# EAGLE design BumperDuino (EAGLE 6.4)
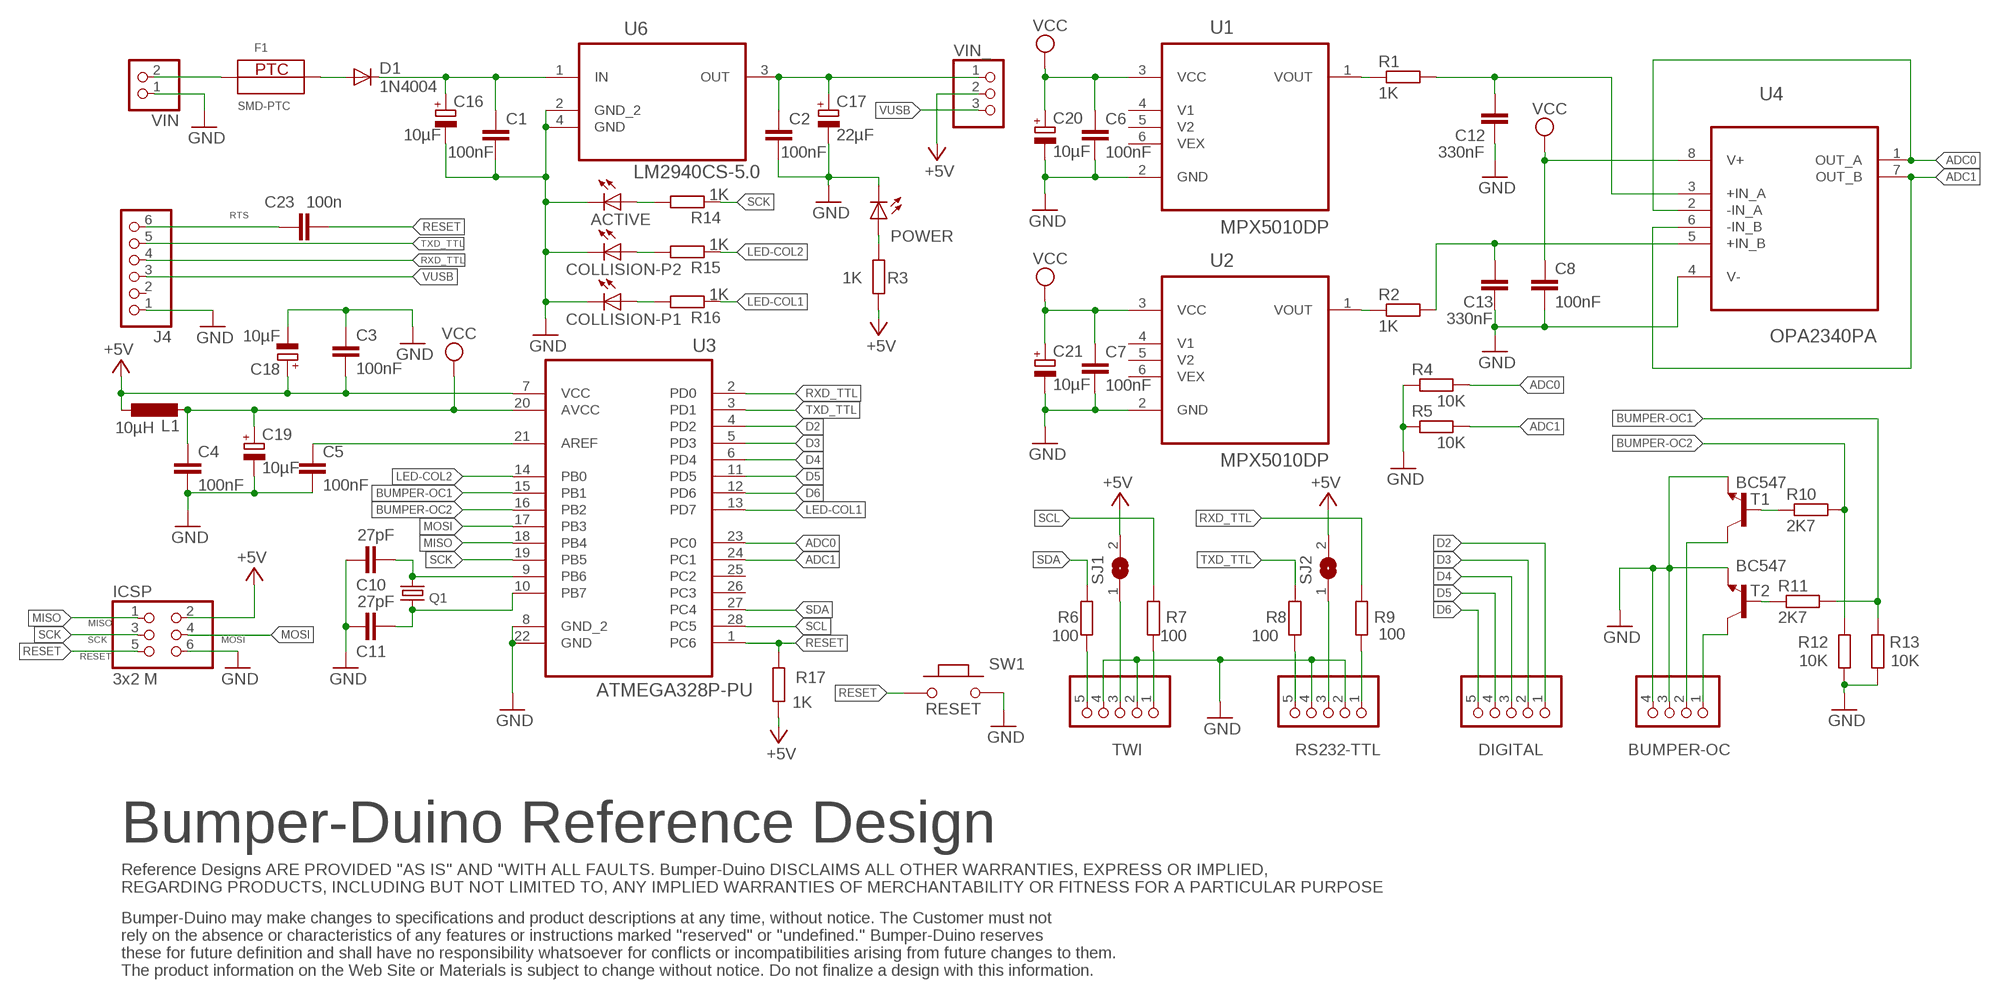
[diagram p0: schematic, sheet 1]

## Parts
ACTIVE  LED3MM  [LED3MM]
BUMPER-OC  PINHD-1X4  [1X04]
C1  100nF  C-EU025-025X050  [C025-025X050]
C2  100nF  C-EU025-025X050  [C025-025X050]
C3  100nF  C-EU025-025X050  [C025-025X050]
C4  100nF  C-EU025-025X050  [C025-025X050]
C5  100nF  C-EU025-025X050  [C025-025X050]
C6  100nF  C-EU025-025X050  [C025-025X050]
C7  100nF  C-EU025-025X050  [C025-025X050]
C8  100nF  C-EU025-025X050  [C025-025X050]
C10  27pF  C-EU025-025X050  [C025-025X050]
C11  27pF  C-EU025-025X050  [C025-025X050]
C12  330nF  C-EU025_050-035X075  [C025_050-035X075]
C13  330nF  C-EU025_050-035X075  [C025_050-035X075]
C16  10µF  CPOL-EUE2.5-5  [E2,5-5]
C17  22µF  CPOL-EUE2.5-5  [E2,5-5]
C18  10µF  CPOL-EUE2.5-5  [E2,5-5]
C19  10µF  CPOL-EUE2.5-5  [E2,5-5]
C20  10µF  CPOL-EUE2.5-5  [E2,5-5]
C21  10µF  CPOL-EUE2.5-5  [E2,5-5]
C23  100n  C-EU025-025X050  [C025-025X050]
COLLISION-P1  LED3MM  [LED3MM]
COLLISION-P2  LED3MM  [LED3MM]
D1  1N4004  [DO41-10]
DIGITAL  PINHD-1X5  [1X05]
F1  SMD-PTC  [SMD-PTC]
ICSP  3x2 M  PINHD-2X3  [2X03]
J4  6x1F Low profile (machined)  PINHD-1X6TH  [1X06-TH]
L1  10µH  L-EU0204/7  [0204/7]
POWER  LED3MM  [LED3MM]
Q1  HC49/S  [HC49/S]
R1  1K  R-EU_R1206  [R1206]
R2  1K  R-EU_R1206  [R1206]
R3  1K  R-EU_R1206  [R1206]
R4  10K  R-EU_R1206  [R1206]
R5  10K  R-EU_R1206  [R1206]
R6  100  R-EU_R1206  [R1206]
R7  100  R-EU_R1206  [R1206]
R8  100  R-EU_R1206  [R1206]
R9  100  R-EU_R1206  [R1206]
R10  2K7  R-EU_R1206  [R1206]
R11  2K7  R-EU_R1206  [R1206]
R12  10K  R-EU_R1206  [R1206]
R13  10K  R-EU_R1206  [R1206]
R14  1K  R-EU_R1206  [R1206]
R15  1K  R-EU_R1206  [R1206]
R16  1K  R-EU_R1206  [R1206]
R17  1K  R-EU_R1206  [R1206]
RS232-TTL  PINHD-1X5  [1X05]
SJ1  SJW  [SJW]
SJ2  SJW  [SJW]
SW1  RESET  PB157  [157SW]
T1  BC547  [TO92]
T2  BC547  [TO92]
TWI  PINHD-1X5  [1X05]
U1  MPX5010DP  [FREESCALE_CASE_867C-05]
U2  MPX5010DP  [FREESCALE_CASE_867C-05]
U3  ATMEGA328P-PU  [DIP254P762X457-28]
U4  OPA2340PA  [DIP254P762X508-8]
U6  LM2940CS-5.0  [TO254P1435X464-4N]
VIN  PINHD-1X2  [1X02]
VIN_  PINHD-1X3  [1X03]

## Nets
ADC0: R4.2 U3.23(PC0) U4.1(OUT_A) U4.2(-IN_A)
ADC1: R5.2 U3.24(PC1) U4.6(-IN_B) U4.7(OUT_B)
BUMPER-OC1: R11.2 R13.2 U3.15(PB1)
BUMPER-OC2: R10.2 R12.2 U3.16(PB2)
D2: DIGITAL.1 U3.4(PD2)
D3: DIGITAL.2 U3.5(PD3)
D4: DIGITAL.3 U3.6(PD4)
D5: DIGITAL.4 U3.11(PD5)
D6: DIGITAL.5 U3.12(PD6)
GND [usbvcc]: ACTIVE.K(C) BUMPER-OC.3 BUMPER-OC.4 C1.2 C2.2 C3.1 C4.2 C5.2 C6.2 C7.2 C8.2 C10.1 C11.1 C12.2 C13.2 C16.- C17.- C18.- C19.- C20.- C21.- COLLISION-P1.K(C) COLLISION-P2.K(C) ICSP.6 J4.1 POWER.K(C) R4.1 R5.1 R12.1 R13.1 RS232-TTL.2 RS232-TTL.4 SW1.2 T1.1(E) T2.1(E) TWI.2 TWI.4 U1.2(GND) U2.2(GND) U3.8(GND_2) U3.22(GND) U4.4(V-) U6.2(GND_2) U6.4(GND) VIN.1
LED-COL1: R16.1 U3.13(PD7)
LED-COL2: R15.1 U3.14(PB0)
MISO: ICSP.1 U3.18(PB4)
MOSI: ICSP.4 U3.17(PB3)
N$1: C10.2 Q1.2 U3.9(PB6)
N$2: C11.2 Q1.1 U3.10(PB7)
N$3: R1.1 U1.1(VOUT)
N$8: R2.1 U2.1(VOUT)
N$9 [usbvcc]: C1.1 C16.+ D1.C U6.1(IN)
N$10 [usbvcc]: C2.1 C17.+ U6.3(OUT) VIN_.1
N$13: C5.1 U3.21(AREF)
N$15: C12.1 R1.2 U4.3(+IN_A)
N$16: C13.1 R2.2 U4.5(+IN_B)
N$17: ACTIVE.A R14.2
N$18: COLLISION-P2.A R15.2
N$20 [usbvcc]: D1.A F1.2
N$21 [usbvcc]: F1.1 VIN.2
N$22: POWER.A R3.2
N$23: COLLISION-P1.A R16.2
N$24: R6.1 TWI.5
N$25: R7.1 TWI.1
N$26: R8.1 RS232-TTL.5
N$27: R9.1 RS232-TTL.1
N$28: BUMPER-OC.1 T2.3(C)
N$29: BUMPER-OC.2 T1.3(C)
N$31 [usbvcc]: SJ1.1 TWI.3
N$32: R11.1 T2.2(B)
N$33: R10.1 T1.2(B)
N$34 [usbvcc]: RS232-TTL.3 SJ2.1
RESET: C23.1 ICSP.5 R17.2 SW1.1 U3.1(PC6)
RTS: C23.2 J4.6
RXD_TTL: J4.4 R9.2 U3.2(PD0)
SCK: ICSP.3 R14.1 U3.19(PB5)
SCL: R7.2 U3.28(PC5)
SDA: R6.2 U3.27(PC4)
TXD_TTL: J4.5 R8.2 U3.3(PD1)
V5+ [usbvcc]: C3.2 C18.+ ICSP.2 L1.1 R3.1 R17.1 SJ1.2 SJ2.2 U3.7(VCC) VIN_.2 ; supply symbol labelled +5V
VCC: C4.1 C6.1 C7.1 C8.1 C19.+ C20.+ C21.+ L1.2 U1.3(VCC) U2.3(VCC) U3.20(AVCC) U4.8(V+)
VUSB [usbvcc]: J4.3 VIN_.3
Unconnected: J4.2 U1.4(V1) U1.5(V2) U1.6(VEX) U2.4(V1) U2.5(V2) U2.6(VEX) U3.25(PC2) U3.26(PC3)

## Notes on the sheet
- Bumper-Duino Reference Design
- Reference Designs ARE PROVIDED "AS IS" AND "WITH ALL FAULTS. Bumper-Duino DISCLAIMS ALL OTHER WARRANTIES, EXPRESS OR IMPLIED,
  REGARDING PRODUCTS, INCLUDING BUT NOT LIMITED TO, ANY IMPLIED WARRANTIES OF MERCHANTABILITY OR FITNESS FOR A PARTICULAR PURPOSE
- Bumper-Duino may make changes to specifications and product descriptions at any time, without notice. The Customer must not
  rely on the absence or characteristics of any features or instructions marked "reserved" or "undefined." Bumper-Duino reserves
  these for future definition and shall have no responsibility whatsoever for conflicts or incompatibilities arising from future changes to them.
  The product information on the Web Site or Materials is subject to change without notice. Do not finalize a design with this information.

## Library data of the parts
ACTIVE COLLISION-P1 COLLISION-P2 POWER = led:LED: LED OSRAM: - CHIPLED LG R971, LG N971, LY N971, LG Q971, LY Q971, LO R971, LY R971 LH N974, LH R974 LS Q976, LO Q976, LY Q976 LO Q996 - Hyper CHIPLED LW Q18S LB Q993, LB Q99A, LB R99A - SideLED LS A670, LO A670, LY A670, LG A670, LP A670 LB A673, LV A673, LT A673, LW A673 LH A674 LY A675 LS A676, LA A676, LO A676, LY A676, LW A676 LS A679, LY A679, LG A679 - Hyper Micro SIDELED® LS Y876, LA Y876, LO Y876, LY Y876 LT Y87S - SmartLED LW L88C, LW L88S LB L89C, LB L89S, LG L890 LS L89K, LO L89K, LY L89K LS L896, LA L896, LO L896, LY L896 - TOPLED LS T670, LO T670, LY T670, LG T670, LP T670 LSG T670, LSP T670, LSY T670, LOP T670, LYG T670 LG T671, LOG T671, LSG T671 LB T673, LV T673, LT T673, LW T673 LH T674 LS T676, LA T676, LO T676, LY T676, LB T676, LH T676, LSB T676, LW T676 LB T67C, LV T67C, LT T67C, LS T67K, LO T67K, LY T67K, LW E67C LS E67B, LA E67B, LO E67B, LY E67B, LB E67C, LV E67C, LT E67C LW T67C LS T679, LY T679, LG T679 LS T770, LO T770, LY T770, LG T770, LP T770 LB T773, LV T773, LT T773, LW T773 LH T774 LS E675, LA E675, LY E675, LS T675 LS T776, LA T776, LO T776, LY T776, LB T776 LHGB T686 LT T68C, LB T68C - Hyper Mini TOPLED® LB M676 - Mini TOPLED Santana® LG M470 LS M47K, LO M47K, LY M47K Source: http://www.osram.convergy.de LUXEON: - LUMILED® LXK2-PW12-R00, LXK2-PW12-S00, LXK2-PW14-U00, LXK2-PW14-V00 LXK2-PM12-R00, LXK2-PM12-S00, LXK2-PM14-U00 LXK2-PE12-Q00, LXK2-PE12-R00, LXK2-PE12-S00, LXK2-PE14-T00, LXK2-PE14-U00 LXK2-PB12-K00, LXK2-PB12-L00, LXK2-PB12-M00, LXK2-PB14-N00, LXK2-PB14-P00, LXK2-PB14-Q00 LXK2-PR12-L00, LXK2-PR12-M00, LXK2-PR14-Q00, LXK2-PR14-R00 LXK2-PD12-Q00, LXK2-PD12-R00, LXK2-PD12-S00 LXK2-PH12-R00, LXK2-PH12-S00 LXK2-PL12-P00, LXK2-PL12-Q00, LXK2-PL12-R00 Source: www.luxeon.com KINGBRIGHT: KA-3528ASYC Source: www.kingbright.com
BUMPER-OC = pinhead:PINHD-1X4: PIN HEADER
C1-C8 C10-C13 C23 = resistor:C-EU: CAPACITOR, European symbol
C16-C21 = resistor:CPOL-EU: POLARIZED CAPACITOR, European symbol
D1 = diode:1N4004: DIODE general purpose rectifier, 1 A
DIGITAL RS232-TTL TWI = pinhead:PINHD-1X5: PIN HEADER
F1 = Sicherungen Siba:SMD-PTC
ICSP = SmartPrj:PINHD-2X3: PIN HEADER
J4 = SmartPrj:PINHD-1X6: PIN HEADER
L1 = resistor:L-EU: INDUCTOR, European symbol
Q1 = quartz:HC49/S
R1-R17 = resistor:R-EU_: RESISTOR, European symbol
SJ1 SJ2 = jumper:SJ: SMD solder JUMPER
SW1 = MySMD:PB157
T1 T2 = transistor:BC547: NPN TRANSISTOR
U1 U2 = MXP5010DP:MPX5010DP: IC, IC, PRESSURE SENSOR,CASE 867C-05; MPN: MPX5010DP; OC_FARNELL: 1555605; OC_NEWARK: 07F9909; PACKAGE: CASE 867C-05; SUPPLIER: FREESCALE SEMICONDUCTOR
U3 = Atmel_By_element14_Batch_1-00:ATMEGA328P-PU: 8-bit Microcontroller with In-System Programmable Flash; MPN: ATMEGA328P-PU; OC_FARNELL: 1715487; OC_NEWARK: 15R0268; PACKAGE: PDIP-28; SUPPLIER: Atmel
U4 = OPA2340PA:OPA2340PA: OPERATIONAL AMPLIFIER; MPN: OPA2340PA; OC_FARNELL: 1129252; OC_NEWARK: 62K3460; PACKAGE: PDIP; SUPPLIER: Texas Instruments
U6 = LM2940CS-5.0:LM2940CS-5.0: Dropout Regulator; MPN: LM2940CS-5.0; OC_FARNELL: 9779850; OC_NEWARK: 07B6352; PACKAGE: TO-263-3; SUPPLIER: NationalSemiconductor
VIN = pinhead:PINHD-1X2: PIN HEADER
VIN_ = pinhead:PINHD-1X3: PIN HEADER

## Net classes
1 power: width 0.152 mm, drill 0.61 mm, clearance 0.152 mm
2 gnd: width 0.305 mm, drill 0.559 mm, clearance 0.254 mm
3 usbvcc: width 0.508 mm, drill 0.61 mm, clearance 0.254 mm

## Board
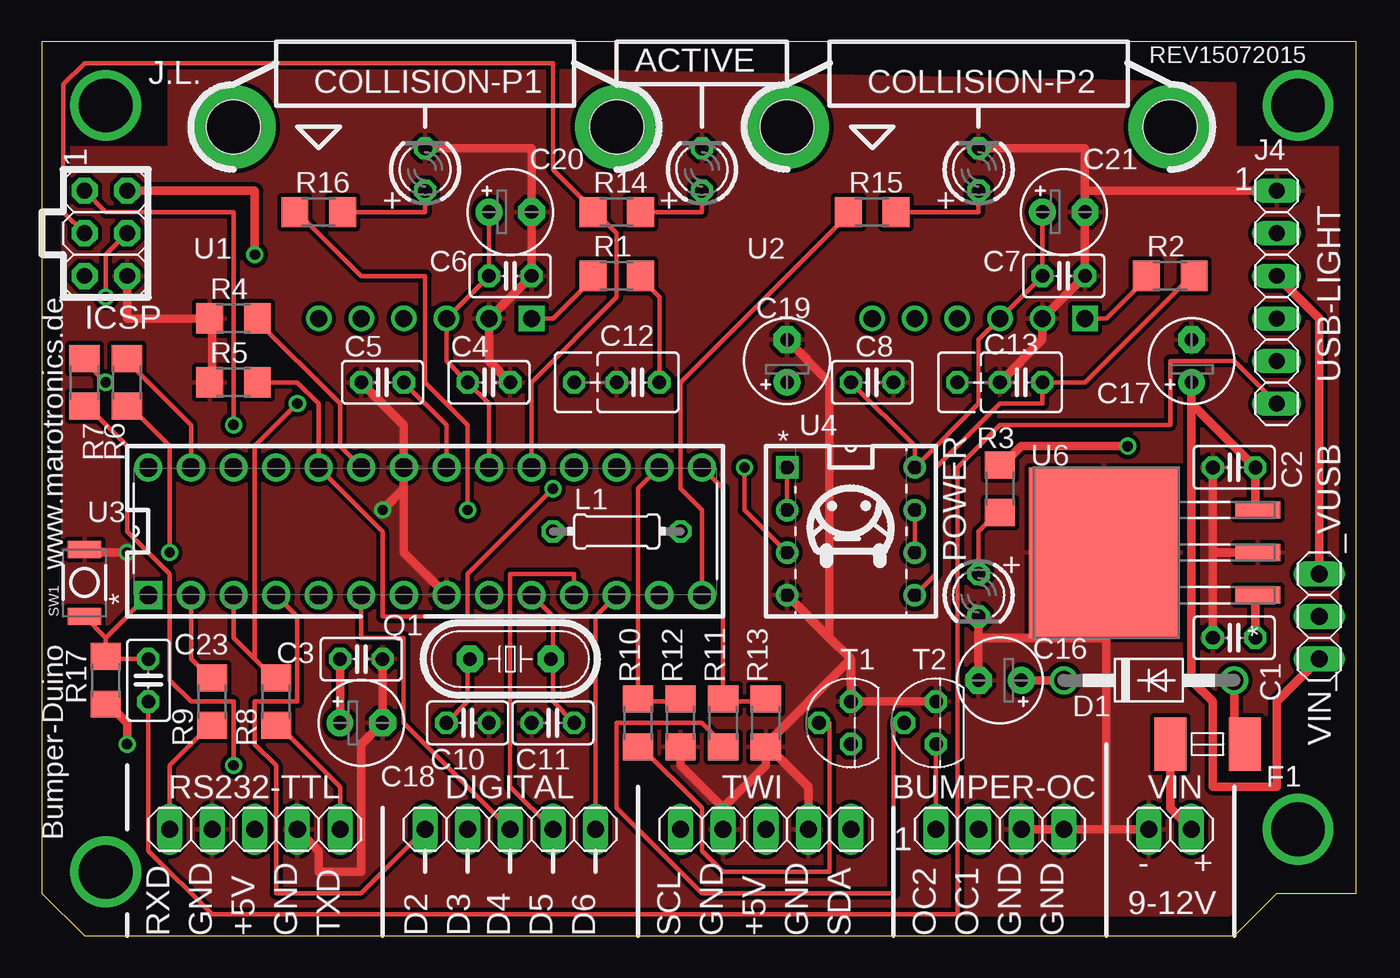
[diagram p1: board, top side]
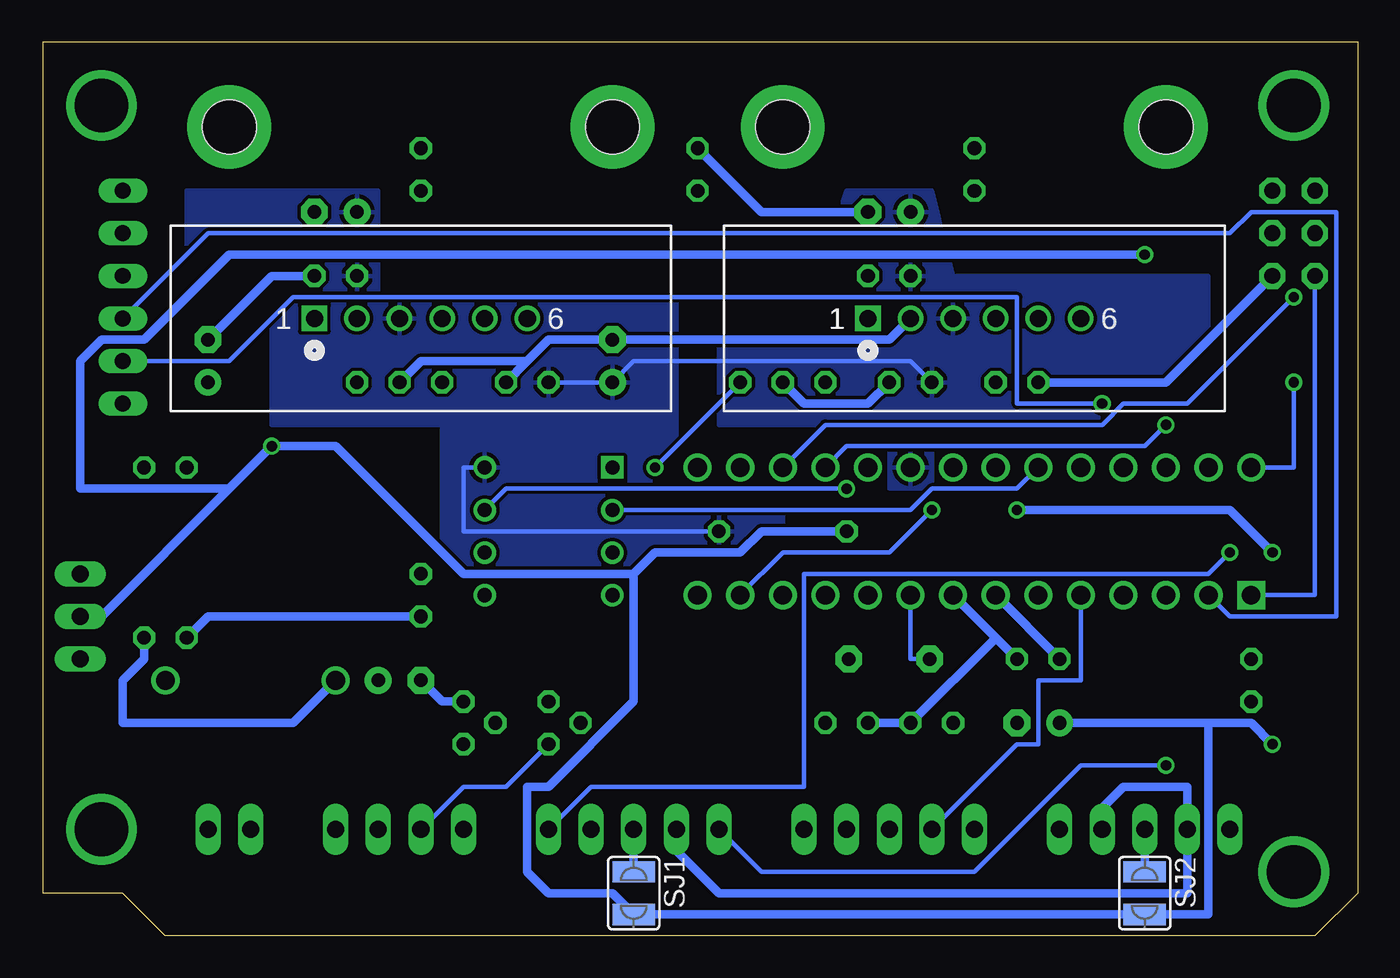
[diagram p2: board, bottom side, seen from below]

Size 78.41 x 53.33 mm. Coordinates in mm from the lower left corner, seen from the top.
Outline: 0,2.54 2.54,0 71.12,0 73.66,2.54 78.41,2.54 78.41,53.33 0,53.33 0,2.54
Copper layers (1*16): Top 0.035mm / dielectric 1.5mm / Bottom 0.035mm
Design rules "default": minimum track width 10mil, minimum drill 24mil, track to track 8mil, track to pad 8mil, pad to pad 8mil, via to via 8mil, smd to smd 8mil, copper to edge 40mil, drill to drill 8mil, minimum pad ring 10mil, minimum via ring 8mil, stop-mask expansion 4mil, vias tented up to drill 0mil, thermal gap 10mil
Holes 3.2 mm at 11.43,48.26 34.29,48.26 44.45,48.26 67.31,48.26

### Footprints (pad centres in the part's own frame; a part is rotated, then mirrored left to right if it is on the bottom)
LED3MM = drill 0.813 octagon: A -1.27,0; K 1.27,0
1X04 = drill 1.016 long: 1 -3.81,0; 2 -1.27,0; 3 1.27,0; 4 3.81,0
C025-025X050 = drill 0.813 octagon: 1 -1.27,0; 2 1.27,0
C025_050-035X075 = drill 0.813 octagon: 1 -1.27,0; 2 1.27,0; 3 3.81,0
E2,5-5 = drill 0.813 pad 1.6: + -1.27,0 | drill 0.813 pad 1.6 octagon: - 1.27,0
DO41-10 = drill 1.118: A 5.08,0; C -5.08,0
1X05 = drill 1.016 long: 1 -5.08,0; 2 -2.54,0; 3 0,0; 4 2.54,0; 5 5.08,0
SMD-PTC = smd 1.9 x 3.2: 1 0,0; 2 4.445,0
2X03 = drill 0.95 pad 1.55 octagon: 1 -2.54,-1.27; 2 -2.54,1.27; 3 0,-1.27; 4 0,1.27; 5 2.54,-1.27; 6 2.54,1.27
1X06-TH = drill 0.95 pad 1.422 long: 1 -6.35,0; 2 -3.81,0; 3 -1.27,0; 4 1.27,0; 5 3.81,0; 6 6.35,0
0204/7 = drill 0.813 octagon: 1 -3.81,0; 2 3.81,0
HC49/S = drill 0.813 pad 1.6 octagon: 1 -2.413,0; 2 2.413,0
R1206 = smd 1.6 x 1.803: 1 -1.422,0; 2 1.422,0
SJW = smd 1.27 x 2.54: 1 -1.27,0; 2 1.27,0
157SW = smd 1.016 x 1.981: 1 0,0; 2 4,0
TO92 = drill 0.813 octagon: 1 1.27,0; 2 0,1.905; 3 -1.27,0
FREESCALE_CASE_867C-05 = drill 1.016 square: 1 -12.7,0 | drill 1.016: 2 -10.16,0; 3 -7.62,0; 4 -5.08,0; 5 -2.54,0; 6 0,0
DIP254P762X457-28 = drill 1.118 square: 1 -7.62,33.02 | drill 1.118: 2 -7.62,30.48; 3 -7.62,27.94; 4 -7.62,25.4; 5 -7.62,22.86; 6 -7.62,20.32; 7 -7.62,17.78; 8 -7.62,15.24; 9 -7.62,12.7; 10 -7.62,10.16; 11 -7.62,7.62; 12 -7.62,5.08; 13 -7.62,2.54; 14 -7.62,0; 15 0,0; 16 0,2.54; 17 0,5.08; 18 0,7.62; 19 0,10.16; 20 0,12.7; 21 0,15.24; 22 0,17.78; 23 0,20.32; 24 0,22.86; 25 0,25.4; 26 0,27.94; 27 0,30.48; 28 0,33.02
DIP254P762X508-8 = drill 0.838 square: 1 -7.62,7.62 | drill 0.838: 2 -7.62,5.08; 3 -7.62,2.54; 4 -7.62,0; 5 0,0; 6 0,2.54; 7 0,5.08; 8 0,7.62
TO254P1435X464-4N = smd 1.016 x 2.692: 1 -2.54,-9.042; 2 0,-9.042; 3 2.54,-9.042 | smd 10.16 x 8.941: 4 0,0.152
1X02 = drill 1.016 long: 1 -1.27,0; 2 1.27,0
1X03 = drill 1.016 long: 1 -2.54,0; 2 0,0; 3 2.54,0

### Placement (x,y rotation side)
ACTIVE  39.37,45.72 90 top
BUMPER-OC  57.15,6.35 0 top
C1  71.12,17.78 180 top
C2  71.12,27.94 180 top
C3  19.05,16.51 180 top
C4  26.67,33.02 0 top
C5  20.32,33.02 180 top
C6  27.94,39.37 0 top
C7  60.96,39.37 0 top
C8  49.53,33.02 0 top
C10  25.4,12.7 180 top
C11  30.48,12.7 0 top
C12  35.56,33.02 180 top
C13  58.42,33.02 180 top
C16  57.15,15.24 180 top
C17  68.58,34.29 90 top
C18  19.05,12.7 0 top
C19  44.45,34.29 90 top
C20  27.94,43.18 0 top
C21  60.96,43.18 0 top
C23  6.35,15.24 270 top
COLLISION-P1  22.86,45.72 90 top
COLLISION-P2  55.88,45.72 90 top
D1  66.04,15.24 0 top
DIGITAL  27.94,6.35 0 top
F1  67.31,11.43 0 top
ICSP  3.81,41.91 270 top
J4  73.66,38.1 270 top
L1  34.29,24.13 0 top
POWER  55.88,20.32 270 top
Q1  27.94,16.51 180 top
R1  34.29,39.37 0 top
R2  67.31,39.37 0 top
R3  57.15,26.67 270 top
R4  11.43,36.83 0 top
R5  11.43,33.02 0 top
R6  5.08,33.02 90 top
R7  2.54,33.02 90 top
R8  13.97,13.97 90 top
R9  10.16,13.97 90 top
R10  35.56,12.7 90 top
R11  40.64,12.7 90 top
R12  38.1,12.7 90 top
R13  43.18,12.7 90 top
R14  34.29,43.18 0 top
R15  49.53,43.18 0 top
R16  16.51,43.18 0 top
R17  3.81,15.24 90 top
RS232-TTL  12.7,6.35 0 top
SJ1  43.18,2.54 270 bottom
SJ2  12.7,2.54 270 bottom
SW1  2.54,19.05 90 top
T1  48.26,12.7 90 top
T2  53.34,12.7 90 top
TWI  43.18,6.35 0 top
U1  16.51,36.83 0 bottom
U2  49.53,36.83 0 bottom
U3  39.37,27.94 90 top
U4  52.07,20.32 0 top
U6  63.5,22.86 90 top
VIN  67.31,6.35 0 top
VIN_  76.2,19.05 90 top

### Tracks (layer width: path | path; a pad name or v marks a point on that pad's centre or on a via)
ADC0
  Top 0.254: U4.1 U4.2 | U3.23 17.78,29.21 17.78,31.75 12.7,36.83 R4.2
  Bottom 0.254: U4.2 26.67,25.4 25.4,26.67 20.32,26.67 U3.23
ADC1  (via drill 0.61)
  Top 0.254: U4.7 U4.6 | 12.7,33.02 R5.2 15.24,33.02 16.51,31.75 U3.24 20.32,24.13 20.32,19.05 25.4,19.05 25.4,21.59 v30.48,26.67
  Bottom 0.254: U4.7 50.8,26.67 v30.48,26.67
BUMPER-OC1
  Top 0.254: R13.2 43.18,13.97 40.64,13.97 R11.2 40.64,26.67 U3.15
BUMPER-OC2
  Top 0.254: R12.2 38.1,13.97 35.56,13.97 R10.2 35.56,26.67 U3.16
D2
  Top 0.254: DIGITAL.1 19.05,2.54 13.97,2.54 13.97,10.16 12.7,11.43 12.7,13.97 15.24,13.97 15.24,19.05 U3.4
D3
  Bottom 0.254: DIGITAL.2 20.32,11.43 19.05,11.43 19.05,15.24 16.51,15.24 U3.5
D4
  Top 0.254: DIGITAL.3 21.59,12.7 21.59,17.78 19.05,17.78 U3.6
D5
  Top 0.254: DIGITAL.4 27.94,8.89 27.94,21.59 31.75,21.59 U3.11
D6
  Top 0.254: DIGITAL.5 33.02,19.05 U3.12
GND  (via drill 0.61)
  Top 0.508: C3.1 C18.- 19.05,11.43 19.05,3.81 16.51,3.81 16.51,5.08 RS232-TTL.4 | R5.1 10.16,33.02 10.16,36.83 R4.1 5.08,36.83 ICSP.6 | v5.08,22.86 2.54,22.86 SW1.2 | 21.59,26.67 v20.32,25.4 | 21.59,26.67 U3.22 21.59,30.48 C5.2 | U3.8 21.59,22.86 21.59,26.67 | BUMPER-OC.3 BUMPER-OC.4 63.5,6.35 | 63.5,6.35 VIN.1 | 63.5,17.78 63.5,22.86 U6.4 | 63.5,17.78 63.5,6.35 | C13.2 59.69,35.56 U2.2 C7.2 C21.- 62.23,44.45 | COLLISION-P2.K 62.23,46.99 62.23,44.45 | 62.23,44.45 J4.1 | C4.2 26.67,34.29 U1.2 C6.2 C20.- 29.21,46.99 COLLISION-P1.K | C2.2 69.85,22.86 | 69.85,22.86 C1.2 | 69.85,22.86 U6.2 | 40.64,7.62 38.1,10.16 R12.1 38.1,11.43 | 43.18,11.43 45.72,8.89 TWI.4 | 40.64,7.62 43.18,10.16 R13.1 43.18,11.43 | 40.64,7.62 TWI.2 | C16.- 55.88,17.78 | 55.88,17.78 POWER.K | T2.1 T1.1 48.26,16.51 | 48.26,16.51 46.99,17.78 | 46.99,17.78 U4.4 | C19.- 46.99,33.02 46.99,17.78 | 48.26,16.51 43.18,11.43 | 55.88,17.78 63.5,17.78
  Bottom 0.508: RS232-TTL.4 15.24,7.62 13.97,8.89 10.16,8.89 RS232-TTL.2 10.16,2.54 38.1,2.54 40.64,5.08 TWI.2 | C11.1 C10.1 21.59,17.78 | C3.1 21.59,17.78 | 21.59,17.78 U3.8 | v5.08,22.86 7.62,25.4 v20.32,25.4 | ICSP.6 11.43,33.02 C5.2 | C17.- 64.77,39.37 C7.2 | C12.2 33.02,31.75 29.21,31.75 C4.2 | ACTIVE.K 35.56,43.18 C20.- | 49.53,34.29 48.26,35.56 C19.- 27.94,35.56 U1.2 | 49.53,34.29 C8.2 | C16.- 54.61,13.97 T2.1 | C1.2 68.58,19.05 POWER.K | C13.2 55.88,34.29 49.53,34.29
  pour Top: 1.27,46.99 7.62,46.99 7.62,52.07 71.12,50.8 71.12,46.99 77.47,46.99 77.47,8.89 71.12,8.89 71.12,1.27 6.35,1.27 6.35,7.62 1.27,7.62
LED-COL1  (via drill 0.61)
  Top 0.254: v25.4,25.4 25.4,30.48 22.86,33.02 22.86,39.37 19.05,39.37 15.24,43.18 R16.1
  Bottom 0.254: v25.4,25.4 27.94,22.86 34.29,22.86 U3.13
LED-COL2
  Top 0.254: U3.14 39.37,25.4 38.1,26.67 38.1,33.02 48.26,43.18 R15.1
MISO  (via drill 0.61)
  Top 0.254: ICSP.1 3.81,43.18 11.43,43.18 v11.43,30.48
  Bottom 0.254: v11.43,30.48 12.7,29.21 30.48,29.21 U3.18
MOSI  (via drill 0.61)
  Top 0.254: ICSP.4 3.81,40.64 v3.81,38.1
  Bottom 0.254: v3.81,38.1 10.16,31.75 13.97,31.75 15.24,30.48 31.75,30.48 U3.17
N$1
  Top 0.254: C10.2 25.4,13.97 25.4,16.51 Q1.2
  Bottom 0.254: U3.9 26.67,16.51 Q1.2 25.4,16.51
N$2
  Top 0.254: C11.2 30.48,13.97 30.48,16.51 | U3.10 30.48,19.05 30.48,16.51 | 30.48,16.51 Q1.1
N$3
  Top 0.254: U1.1 30.48,36.83 33.02,39.37 R1.1
N$4  (via drill 3.2 pad 5)
  other vias: 11.43,48.26
N$5  (via drill 3.2 pad 5)
  other vias: 34.29,48.26
N$6  (via drill 3.2 pad 5)
  other vias: 44.45,48.26
N$7  (via drill 3.2 pad 5)
  other vias: 67.31,48.26
N$8
  Top 0.254: U2.1 63.5,36.83 66.04,39.37 R2.1
N$9
  Top 0.508: C1.1 72.39,20.32 U6.1 | D1.C C16.+
  Bottom 0.508: C1.1 72.39,16.51 73.66,15.24 73.66,12.7 63.5,12.7 D1.C
N$10
  Top 0.508: U6.3 72.39,25.4 C2.1 68.58,31.75 | VIN_.1 73.66,13.97 73.66,8.89 69.85,8.89 69.85,13.97 68.58,15.24 68.58,31.75 | C17.+ 68.58,31.75
N$11  (via drill 3.2)
  other vias: 74.93,6.35
N$12  (via drill 3.2)
  other vias: 74.93,49.53
N$13
  Top 0.254: C5.1 24.13,30.48 U3.21
N$14  (via drill 3.2)
  other vias: 3.81,49.53
N$15  (via drill 0.61)
  Top 0.254: C12.1 36.83,38.1 35.56,39.37 R1.2 | U4.3 41.91,25.4 v41.91,27.94
  Bottom 0.254: C12.1 v41.91,27.94
N$16
  Top 0.254: R2.2 68.58,39.37 62.23,33.02 C13.1 59.69,31.75 57.15,31.75 53.34,27.94 53.34,21.59 U4.5
N$17
  Top 0.254: ACTIVE.A 39.37,43.18 R14.2 35.56,43.18
N$18
  Top 0.254: COLLISION-P2.A 55.88,43.18 R15.2 50.8,43.18
N$19  (via drill 3.2)
  other vias: 3.81,3.81
N$20
  Top 0.508: D1.A 71.12,11.43 F1.2
N$21
  Top 0.508: VIN.2 67.31,7.62 F1.1
N$22
  Top 0.254: POWER.A 55.88,24.13 57.15,25.4 R3.2
N$23
  Top 0.254: COLLISION-P1.A 22.86,43.18 R16.2 17.78,43.18
N$24  (via drill 0.61)
  Top 0.254: v7.62,22.86 7.62,29.21 5.08,31.75 R6.1
  Bottom 0.254: v7.62,22.86 8.89,21.59 33.02,21.59 33.02,8.89 45.72,8.89 TWI.5
N$25  (via drill 0.61)
  Top 0.254: v11.43,10.16 11.43,13.97 8.89,13.97 7.62,15.24 7.62,21.59 5.08,24.13 5.08,29.21 2.54,31.75 R7.1
  Bottom 0.254: v11.43,10.16 16.51,10.16 22.86,3.81 35.56,3.81 TWI.1
N$26
  Top 0.254: RS232-TTL.5 17.78,8.89 13.97,12.7 R8.1
N$27
  Top 0.254: RS232-TTL.1 7.62,10.16 10.16,12.7 R9.1
N$28
  Top 0.254: BUMPER-OC.1 T2.3
N$29
  Bottom 0.254: T1.3 50.8,8.89 53.34,8.89 BUMPER-OC.2
N$31
  Bottom 0.508: TWI.3 SJ1.1
N$32
  Top 0.254: R11.1 40.64,11.43 39.37,12.7 34.29,12.7 34.29,7.62 39.37,2.54 50.8,2.54 50.8,12.7 T2.2
N$33
  Top 0.254: R10.1 35.56,11.43 39.37,7.62 39.37,5.08 40.64,3.81 46.99,3.81 46.99,12.7 T1.2
N$34
  Bottom 0.508: RS232-TTL.3 SJ2.1
RESET
  Top 0.254: C23.1 3.81,16.51 R17.2 3.81,17.78 | 3.81,17.78 SW1.1 | U3.1 3.81,17.78
  Bottom 0.254: ICSP.5 2.54,20.32 U3.1
RTS
  Top 0.254: C23.2 6.35,5.08 10.16,1.27 54.61,1.27 54.61,27.94 57.15,30.48 67.31,30.48 67.31,34.29 71.12,34.29 J4.6
RXD_TTL
  Top 0.254: U3.2 8.89,16.51 10.16,15.24 R9.2
  Bottom 0.254: J4.4 68.58,41.91 7.62,41.91 6.35,43.18 1.27,43.18 1.27,19.05 7.62,19.05 U3.2
SCK
  Top 0.254: 33.02,43.18 34.29,41.91 34.29,38.1 29.21,33.02 U3.19 | ICSP.3 1.27,43.18 1.27,50.8 2.54,52.07 30.48,52.07 30.48,45.72 33.02,43.18 | 33.02,43.18 R14.1
SCL  (via drill 0.61)
  Top 0.254: v3.81,33.02 2.54,34.29 R7.2
  Bottom 0.254: v3.81,33.02 3.81,27.94 U3.28
SDA
  Top 0.254: U3.27 8.89,30.48 5.08,34.29 R6.2
TXD_TTL  (via drill 0.61)
  Top 0.254: 12.7,16.51 11.43,17.78 U3.3 | 12.7,16.51 13.97,15.24 R8.2 | v15.24,31.75 12.7,29.21 12.7,16.51
  Bottom 0.254: J4.5 67.31,34.29 63.5,38.1 20.32,38.1 20.32,31.75 v15.24,31.75
V5+  (via drill 0.61)
  Top 0.508: v5.08,11.43 5.08,12.7 3.81,13.97 R17.1 | C18.+ C3.2 | v64.77,29.21 58.42,29.21 57.15,27.94 R3.1 | ICSP.2 12.7,44.45 v12.7,40.64
  Bottom 0.508: v5.08,11.43 6.35,12.7 8.89,12.7 | C18.+ 8.89,12.7 | C3.2 U3.7 | 8.89,12.7 8.89,1.27 SJ2.2 SJ1.2 44.45,2.54 48.26,2.54 49.53,3.81 49.53,8.89 48.26,8.89 43.18,13.97 43.18,21.59 | 67.31,26.67 74.93,19.05 VIN_.2 | 67.31,26.67 v64.77,29.21 60.96,29.21 53.34,21.59 43.18,21.59 | L1.1 35.56,24.13 36.83,22.86 41.91,22.86 43.18,21.59 | v12.7,40.64 67.31,40.64 72.39,35.56 74.93,35.56 76.2,34.29 76.2,26.67 67.31,26.67
VCC
  Top 0.254: C20.+ C6.1 U1.3 24.13,34.29 C4.1 26.67,31.75 U3.20 | C21.+ C7.1 U2.3 55.88,35.56 55.88,31.75 U4.8 52.07,29.21 C8.1
  Bottom 0.254: C8.1 C19.+ 43.18,34.29 26.67,34.29 C4.1 | L1.2 53.34,24.13 53.34,27.94 U4.8
  pour Bottom: 34.29,25.4 34.29,22.86 41.91,22.86 41.91,17.78 54.61,17.78 54.61,30.48 64.77,30.48 64.77,38.1 69.85,38.1 69.85,44.45 58.42,44.45 58.42,38.1 41.91,38.1 40.64,38.1 40.64,25.4
  pour Bottom: 27.94,26.67 25.4,26.67 25.4,29.21 8.89,29.21 8.89,39.37 24.13,39.37 25.4,44.45 30.48,44.45 31.75,40.64 38.1,40.64 38.1,30.48 27.94,30.48
VUSB
  Top 0.508: J4.3 76.2,36.83 VIN_.3

### Text on the board
tPlace: REV15072015 | J.L. | 1 | 1 | + | + | + | www.marotronics.de | USB-LIGHT | + | _VUSB | Bumper-Duino | 1 | - | + | D2 | D3 | 9-12V | RXD | GND | +5V | GND | TXD | D4 | D5 | D6 | SCL | GND | +5V | GND | SDA | OC2 | OC1 | GND | GND
Document: Bumper-Duino Reference Design | Reference Designs ARE PROVIDED "AS IS" AND "WITH ALL FAULTS. Bumper-Duino DISCLAIMS ALL OTHER WARRANTIES, EXPRESS OR IMPLIED, / REGARDING PRODUCTS, INCLUDING BUT NOT LIMITED TO, ANY IMPLIED WARRANTIES OF MERCHANTABILITY OR FITNESS FOR A PARTICULAR PURPOSE | Bumper-Duino may make changes to specifications and product descriptions at any time, without notice. The Customer must not / rely on the absence or characteristics of any features or instructions marked "reserved" or "undefined." Bumper-Duino reserves / these for future definition and shall have no responsibility whatsoever for conflicts or incompatibilities arising from future changes to them. / The product information on the Web Site or Materials is subject to change without notice. Do not finalize a design with this information.